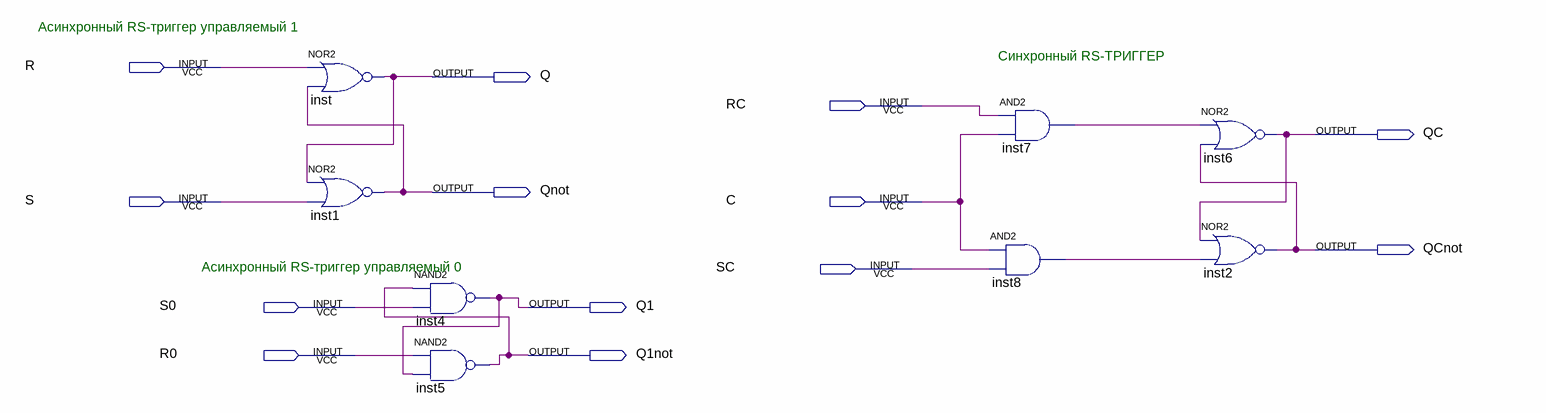
[diagram p0: schematic sheet]
// Quartus schematic CMB8.bdf as structural Verilog: 8 symbols, 13 pins
module CMB8 (
  input  R,
  input  RC,
  input  S,
  input  C,
  input  SC,
  input  S0,
  input  R0,
  output Q,
  output QC,
  output Qnot,
  output QCnot,
  output Q1,
  output Q1not
);

  wire inst7_out, inst8_out;

  nor inst (Q, R, Qnot);
  nor inst1 (Qnot, Q, S);
  nand inst4 (Q1, Q1not, S0);
  nand inst5 (Q1not, R0, Q1);
  and inst7 (inst7_out, RC, C);
  and inst8 (inst8_out, C, SC);
  nor inst6 (QC, inst7_out, QCnot);
  nor inst2 (QCnot, QC, inst8_out);

  // Notes on the sheet:
  //   Асинхронный RS-триггер управляемый 1
  //   Синхронный RS-ТРИГГЕР
  //   Асинхронный RS-триггер управляемый 0
endmodule
